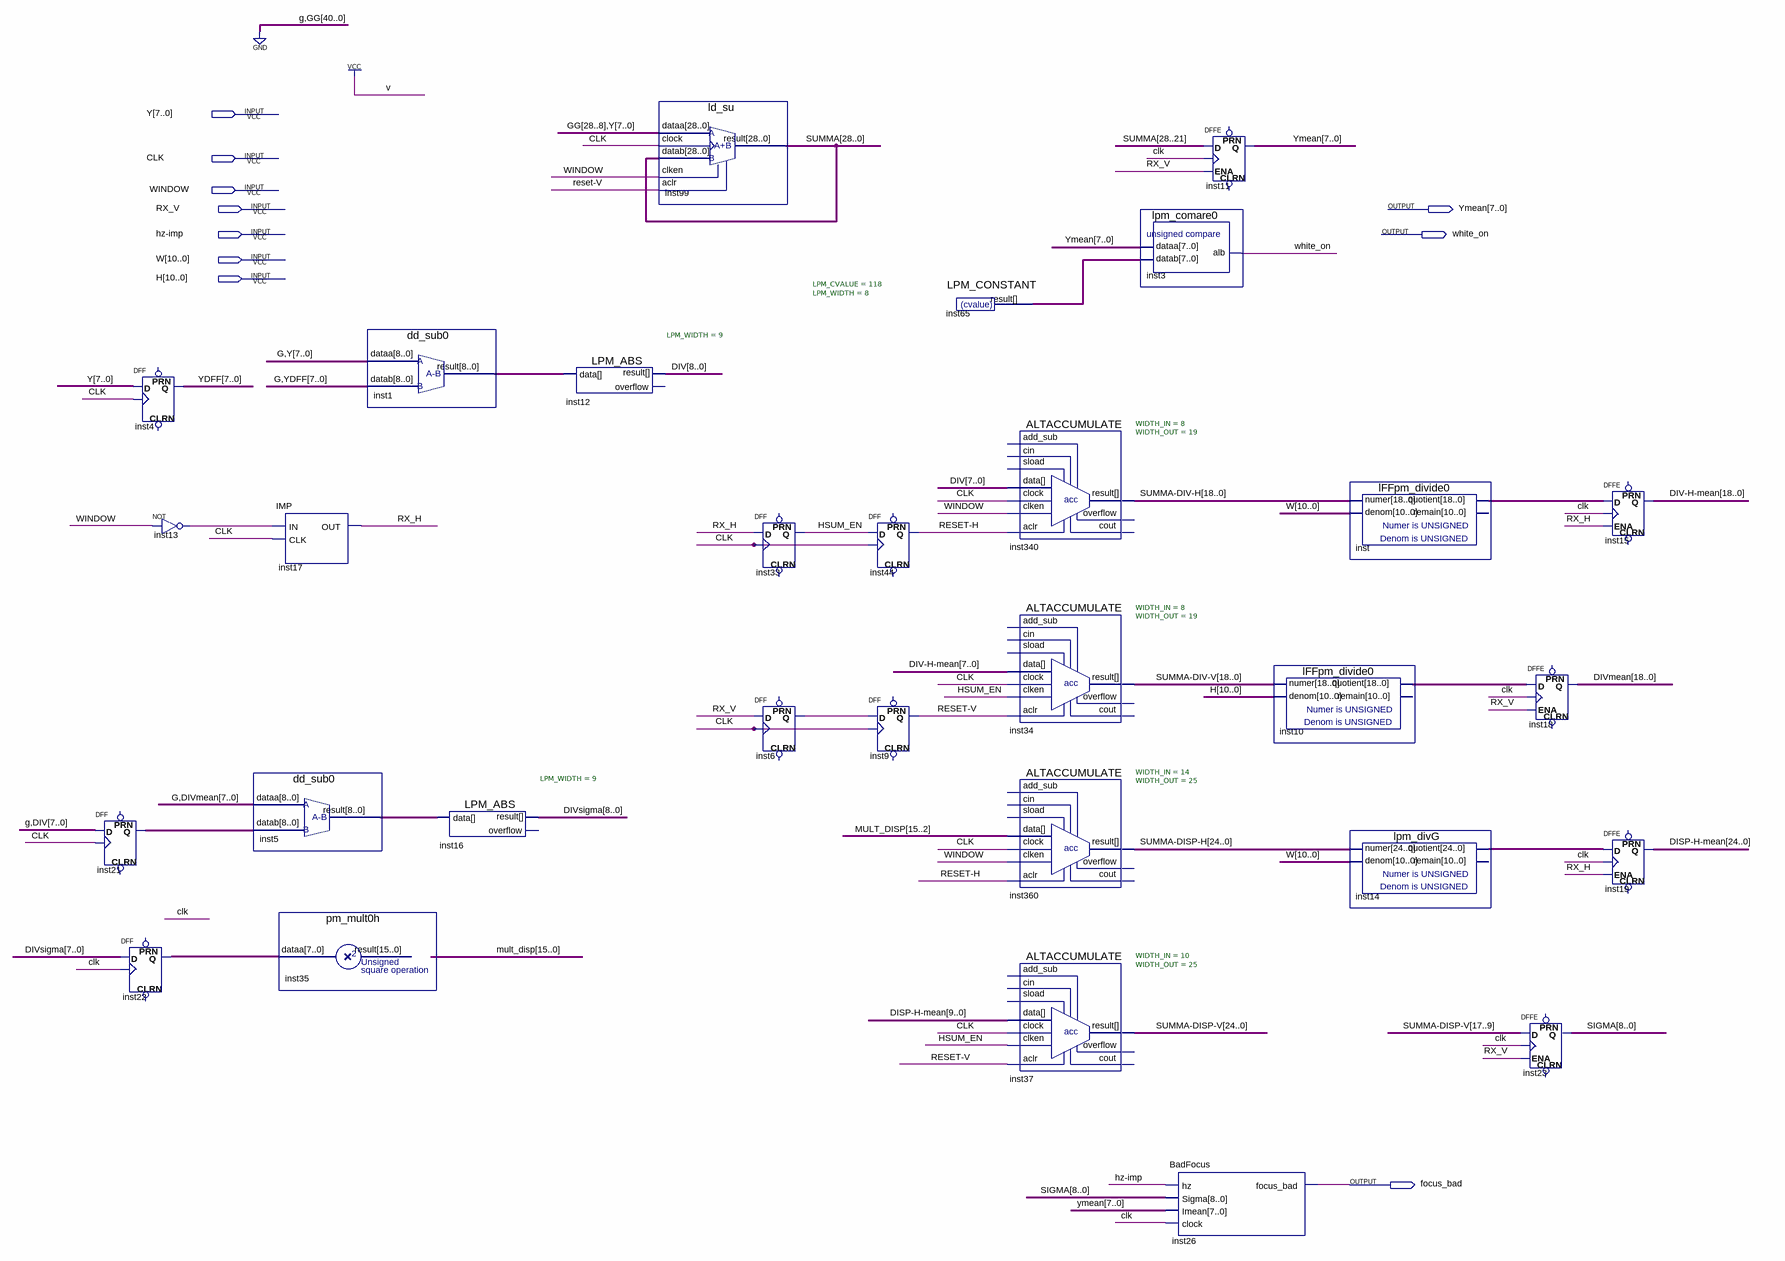
[diagram p0: schematic sheet]
// Quartus schematic Ymean_Focus.bdf as structural Verilog: 30 symbols, 10 pins
module Ymean_Focus (
  input  [7:0] Y,
  input  CLK,
  input  WINDOW,
  input  RX_V,
  input  \hz-imp ,
  input  [10:0] W,
  input  [10:0] H,
  output [7:0] Ymean,
  output white_on,
  output focus_bad
);

  wire HSUM_EN, inst6_q, inst13_out, \RESET-H , \RESET-V , RX_H;
  wire [7:0] inst22_q, inst65_result, YDFF;
  wire [8:0] DIV, DIVsigma, inst1_result, inst5_result, inst21_q, SIGMA;
  wire [15:0] MULT_DISP;
  wire [18:0] \DIV-H-mean , DIVmean, inst10_quotient, inst_quotient, \SUMMA-DIV-H , \SUMMA-DIV-V ;
  wire [24:0] \DISP-H-mean , inst14_quotient, \SUMMA-DISP-H , \SUMMA-DISP-V ;
  wire [28:0] SUMMA;

  DFF inst21[8:0] (.CLK(CLK), .D({1'b0, DIV[7:0]}), .Q(inst21_q));  // open: CLRN, PRN
  DFF inst4[7:0] (.CLK(CLK), .D(Y), .Q(YDFF));  // open: CLRN, PRN
  DFF inst22[7:0] (.CLK(CLK), .D(DIVsigma[7:0]), .Q(inst22_q));  // open: CLRN, PRN
  not inst13 (inst13_out, WINDOW);
  IMP inst17 (.IN(inst13_out), .CLK(CLK), .OUT(RX_H));
  dd_sub0 inst5 (.dataa({1'b0, DIVmean[7:0]}), .datab(inst21_q), .result(inst5_result));
  pm_mult0h inst35 (.dataa(inst22_q), .result(MULT_DISP));
  dd_sub0 inst1 (.dataa({1'b0, Y}), .datab({1'b0, YDFF}), .result(inst1_result));
  LPM_ABS #(.LPM_WIDTH(9)) inst16 (.data(inst5_result), .result(DIVsigma));  // open: overflow
  LPM_ABS #(.LPM_WIDTH(9)) inst12 (.data(inst1_result), .result(DIV));  // open: overflow
  ld_su inst99 (.dataa({{21{1'b0}}, Y}), .datab(SUMMA), .clken(WINDOW), .aclr(\RESET-V ), .clock(CLK), .result(SUMMA));
  DFF inst33 (.CLK(CLK), .D(RX_H), .Q(HSUM_EN));  // open: CLRN, PRN
  DFF inst6 (.CLK(CLK), .D(RX_V), .Q(inst6_q));  // open: CLRN, PRN
  DFF inst44 (.CLK(CLK), .D(HSUM_EN), .Q(\RESET-H ));  // open: CLRN, PRN
  DFF inst9 (.CLK(CLK), .D(inst6_q), .Q(\RESET-V ));  // open: CLRN, PRN
  LPM_CONSTANT #(.LPM_CVALUE(118), .LPM_WIDTH(8)) inst65 (.result(inst65_result));
  ALTACCUMULATE #(.WIDTH_IN(8), .WIDTH_OUT(19)) inst340 (
    .aclr(\RESET-H ), .clock(CLK), .clken(WINDOW), .data(DIV[7:0]), .result(\SUMMA-DIV-H ));  // open: add_sub, cin, sload, cout, overflow
  ALTACCUMULATE #(.WIDTH_IN(8), .WIDTH_OUT(19)) inst34 (
    .aclr(\RESET-V ), .clock(CLK), .clken(HSUM_EN), .data(\DIV-H-mean [7:0]), .result(\SUMMA-DIV-V ));  // open: add_sub, cin, sload, cout, overflow
  ALTACCUMULATE #(.WIDTH_IN(14), .WIDTH_OUT(25)) inst360 (
    .aclr(\RESET-H ), .clock(CLK), .clken(WINDOW), .data(MULT_DISP[15:2]), .result(\SUMMA-DISP-H ));  // open: add_sub, cin, sload, cout, overflow
  ALTACCUMULATE #(.WIDTH_IN(10), .WIDTH_OUT(25)) inst37 (
    .aclr(\RESET-V ), .clock(CLK), .clken(HSUM_EN), .data(\DISP-H-mean [9:0]), .result(\SUMMA-DISP-V ));  // open: add_sub, cin, sload, cout, overflow
  lpm_comare0 inst3 (.dataa(Ymean), .datab(inst65_result), .alb(white_on));
  DFFE inst11[7:0] (.D(SUMMA[28:21]), .CLK(CLK), .ENA(RX_V), .Q(Ymean));  // open: PRN, CLRN
  BadFocus inst26 (.hz(\hz-imp ), .Sigma(SIGMA), .Imean(Ymean), .clock(CLK), .focus_bad(focus_bad));
  lFFpm_divide0 inst10 (.numer(\SUMMA-DIV-V ), .denom(H), .quotient(inst10_quotient));  // open: remain
  lFFpm_divide0 inst (.numer(\SUMMA-DIV-H ), .denom(W), .quotient(inst_quotient));  // open: remain
  lpm_divG inst14 (.numer(\SUMMA-DISP-H ), .denom(W), .quotient(inst14_quotient));  // open: remain
  DFFE inst18[18:0] (.D(inst10_quotient), .CLK(CLK), .ENA(RX_V), .Q(DIVmean));  // open: PRN, CLRN
  DFFE inst23[8:0] (.D(\SUMMA-DISP-V [17:9]), .CLK(CLK), .ENA(RX_V), .Q(SIGMA));  // open: PRN, CLRN
  DFFE inst15[18:0] (.D(inst_quotient), .CLK(CLK), .ENA(RX_H), .Q(\DIV-H-mean ));  // open: PRN, CLRN
  DFFE inst19[24:0] (.D(inst14_quotient), .CLK(CLK), .ENA(RX_H), .Q(\DISP-H-mean ));  // open: PRN, CLRN
endmodule
